# Altium schematic sheet 74LVC2G17GW_125.SchDoc
size A; SheetNumber: 1; SheetTotal: 1
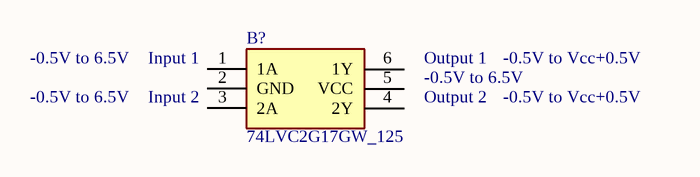
[diagram p0: 74LVC2G17GW_125.SchDoc]

## Parts
B?  74LVC2G17GW_125  [SOT65P210X110-6N]

## Nets

Not connected (* = marked no-connect by the designer): B? 1(1A) 2(GND) 3(2A) 4(2Y) 5(VCC) 6(1Y)

## Notes on the sheet
- -0.5V to 6.5V
- (near B?) Input 1
- (near B?) -0.5V to 6.5V
- (near B?) Output 1
- -0.5V to Vcc+0.5V
- (near B?) Input 2
- (near B?) Output 2

## Library data of the parts
B? = 74LVC2G17GW_125: NXP 74LVC2G17GW,125, Dual Non-Inverting Schmitt Trigger Single Ended Buffer, 1.65  5.5 V, 6-Pin SC-88; Manufacturer_Name: Nexperia; Geometry.Height: 1.1mm; Manufacturer_Part_Number: 74LVC2G17GW,125; Mouser Part Number: 771-LVC2G17GW125; Mouser Price/Stock: https://www.mouser.co.uk/ProductDetail/Nexperia/74LVC2G17GW125?qs=me8TqzrmIYUC6E0%2FnH98oA%3D%3D; Arrow Part Number: 74LVC2G17GW,125; Arrow Price/Stock: https://www.arrow.com/en/products/74lvc2g17gw125/nexperia?utm_currency=USD&region=nac; Datasheet Link: https://assets.nexperia.com/documents/data-sheet/74LVC2G17.pdf